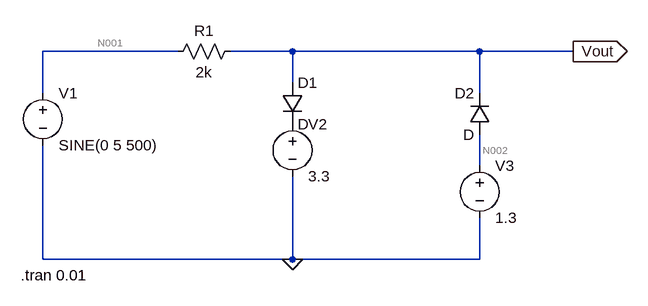
[diagram p0: schematic Draft3.asc]
Draft3.asc, the LTspice schematic file:
Version 4
SHEET 1 944 680
WIRE 224 64 16 64
WIRE 400 64 304 64
WIRE 688 64 400 64
WIRE 832 64 688 64
WIRE 400 112 400 64
WIRE 16 128 16 64
WIRE 688 128 688 64
WIRE 688 240 688 192
WIRE 16 384 16 208
WIRE 400 384 400 256
WIRE 400 384 16 384
WIRE 688 384 688 320
WIRE 688 384 400 384
FLAG 832 64 Vout
IOPIN 832 64 Out
FLAG 400 384 0
SYMBOL voltage 16 112 R0
WINDOW 123 0 0 Left 0
WINDOW 39 0 0 Left 0
SYMATTR InstName V1
SYMATTR Value SINE(0 5 500)
SYMBOL res 320 48 R90
WINDOW 0 0 56 VBottom 2
WINDOW 3 32 56 VTop 2
SYMATTR InstName R1
SYMATTR Value 2k
SYMBOL diode 384 112 R0
SYMATTR InstName D1
SYMBOL voltage 400 160 R0
WINDOW 123 0 0 Left 0
WINDOW 39 0 0 Left 0
SYMATTR InstName V2
SYMATTR Value 3.3
SYMBOL voltage 688 224 R0
WINDOW 123 0 0 Left 0
WINDOW 39 0 0 Left 0
SYMATTR InstName V3
SYMATTR Value 1.3
SYMBOL diode 704 192 R180
WINDOW 0 24 64 Left 2
WINDOW 3 24 0 Left 2
SYMATTR InstName D2
TEXT -18 408 Left 2 !.tran 0.01

The netlist it stands for:
* Draft3.asc
V1 N001 0 SINE(0 5 500)
R1 Vout N001 2k
D1 Vout P001 D
V2 P001 0 3.3
V3 N002 0 1.3
D2 N002 Vout D
.model D D
.lib standard.dio
.tran 0.01
.backanno
.end

* Results of the author's LTspice run, read from the files saved beside the schematic
* Operating Point, zero values left out:
*   V(vout) = 673.1 mV
*   V(p001) = 3.3 V
*   V(n002) = 1.3 V
*   I(D2) = 336.5 µA
*   I(D1) = -2.637 pA
*   I(R1) = 336.5 µA
*   I(V3) = -336.5 µA
*   I(V2) = -2.637 pA
*   I(V1) = 336.5 µA
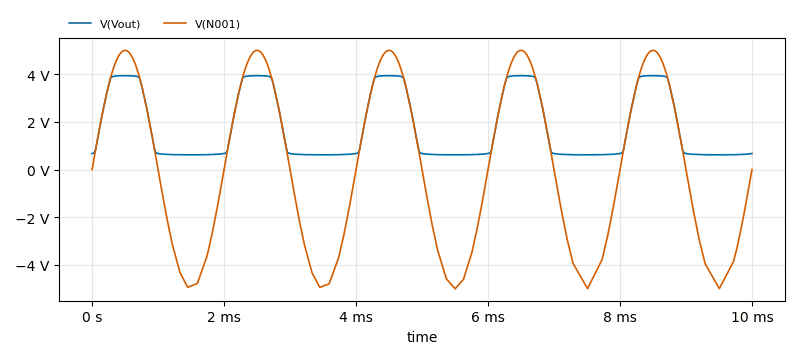
[diagram p1: Transient Analysis of Draft3.asc, plotted from the saved traces]
* Transient Analysis, 1 run:
*   V(Vout): min 618.1 mV, max 3.939 V, average 1.769 V, rms 2.272 V, last 673 mV
*   V(N001): min -5 V, max 5 V, average 26.36 mV, rms 3.513 V, last 0 V